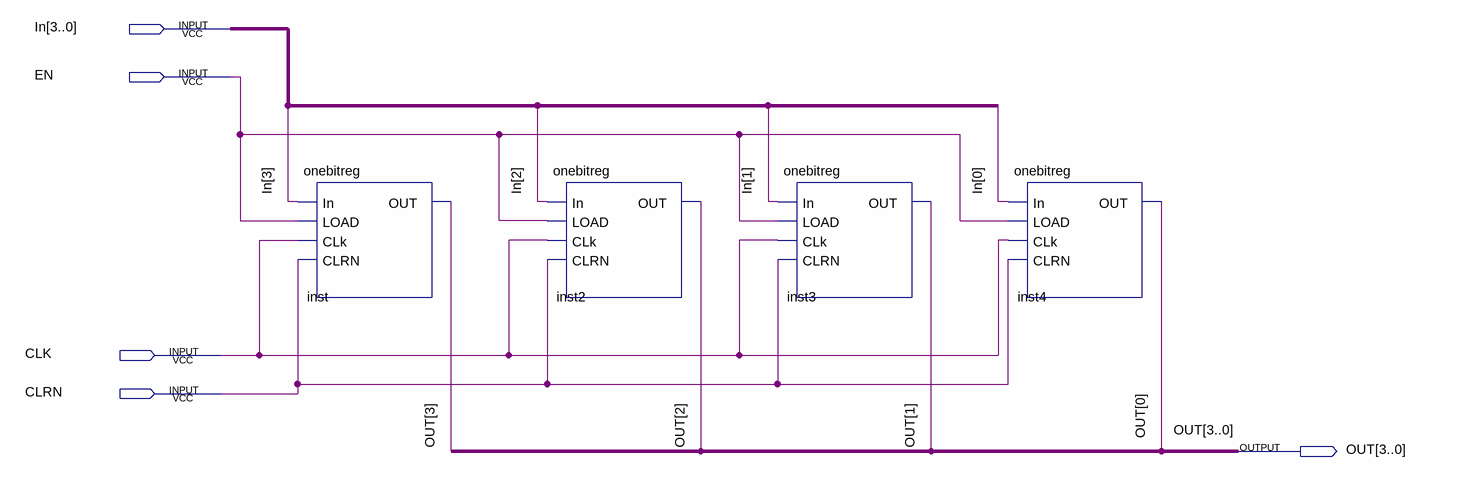
[diagram p0: schematic sheet]
// Quartus schematic ParalelReg.bdf as structural Verilog: 4 symbols, 5 pins
module ParalelReg (
  input  [3:0] In,
  input  EN,
  input  CLK,
  input  CLRN,
  output [3:0] OUT
);

  onebitreg inst (.In(In[3]), .LOAD(EN), .CLk(CLK), .CLRN(CLRN), .OUT(OUT[3]));
  onebitreg inst2 (.In(In[2]), .LOAD(EN), .CLk(CLK), .CLRN(CLRN), .OUT(OUT[2]));
  onebitreg inst3 (.In(In[1]), .LOAD(EN), .CLk(CLK), .CLRN(CLRN), .OUT(OUT[1]));
  onebitreg inst4 (.In(In[0]), .LOAD(EN), .CLk(CLK), .CLRN(CLRN), .OUT(OUT[0]));
endmodule
